# Altium schematic sheet Модуль ВЧ.SchDoc
size 594 x 420 mm; DocumentNumber: 9; SheetNumber: 9; SheetTotal: 11; ListNumber: 1
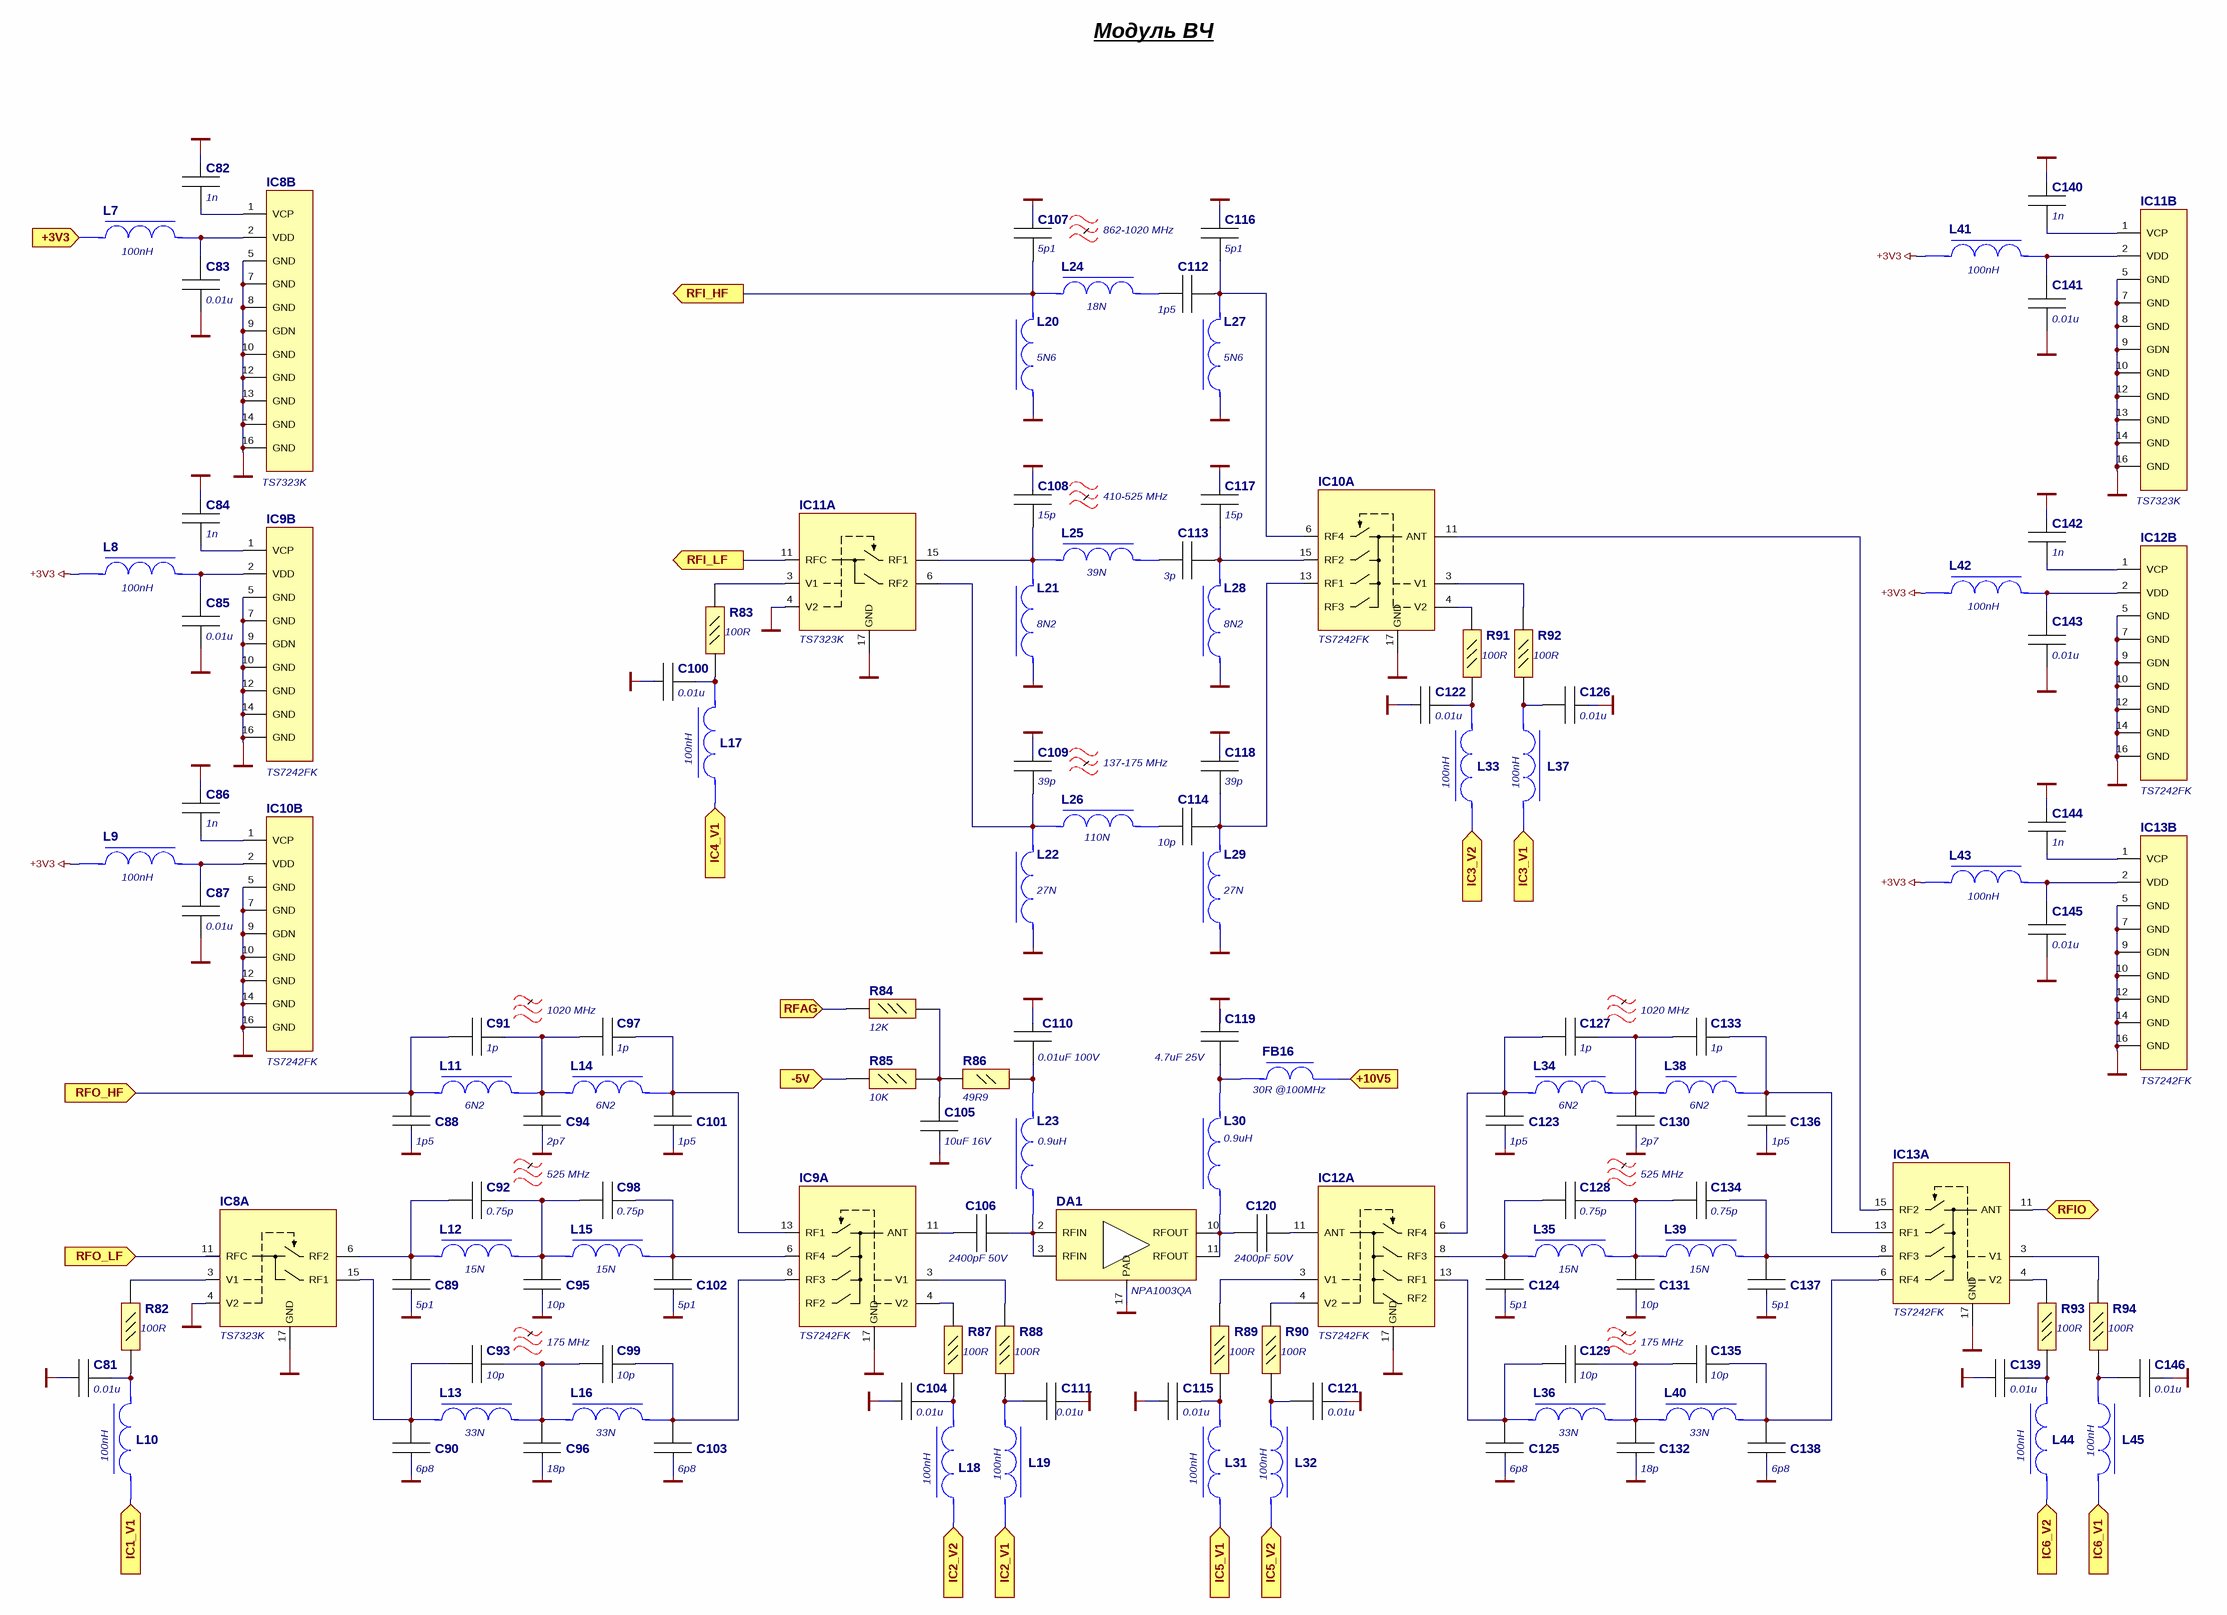
[diagram p0: Модуль ВЧ.SchDoc]

## Parts
C81  0.01u  [:CAP0402 100x50x50]
C82  1n  [:CAP0402 100x50x50]
C83  0.01u  [:CAP0402 100x50x50]
C84  1n  [:CAP0402 100x50x50]
C85  0.01u  [:CAP0402 100x50x50]
C86  1n  [:CAP0402 100x50x50]
C87  0.01u  [:CAP0402 100x50x50]
C88  1p5  [:CAP0603 C1608х08]
C89  5p1  [:CAP0603 C1608х08]
C90  6p8  [:CAP0603 C1608х08]
C91  1p  [:CAP0603 C1608х08]
C92  0.75p  [:CAP0603 C1608х08]
C93  10p  [:CAP0603 C1608х08]
C94  2p7  [:CAP0603 C1608х08]
C95  10p  [:CAP0603 C1608х08]
C96  18p  [:CAP0603 C1608х08]
C97  1p  [:CAP0603 C1608х08]
C98  0.75p  [:CAP0603 C1608х08]
C99  10p  [:CAP0603 C1608х08]
C100  0.01u  [:CAP0402 100x50x50]
C101  1p5  [:CAP0603 C1608х08]
C102  5p1  [:CAP0603 C1608х08]
C103  6p8  [:CAP0603 C1608х08]
C104  0.01u  [:CAP0402 100x50x50]
C105  10uF 16V  [:CAP0805 C2012X125]
C106  2400pF 50V  [:CAP0805 C2012X125]
C107  5p1  [:CAP0603 C1608х08]
C108  15p  [:CAP0603 C1608х08]
C109  39p  [:CAP0603 C1608х08]
C110  0.01uF 100V  [:CAP0603 C1608х08]
C111  0.01u  [:CAP0402 100x50x50]
C112  1p5  [:CAP0603 C1608х08]
C113  3p  [:CAP0603 C1608х08]
C114  10p  [:CAP0603 C1608х08]
C115  0.01u  [:CAP0402 100x50x50]
C116  5p1  [:CAP0603 C1608х08]
C117  15p  [:CAP0603 C1608х08]
C118  39p  [:CAP0603 C1608х08]
C119  4.7uF 25V  [:CAP0805 C2012X125]
C120  2400pF 50V  [:CAP0805 C2012X125]
C121  0.01u  [:CAP0402 100x50x50]
C122  0.01u  [:CAP0402 100x50x50]
C123  1p5  [:CAP0603 C1608х08]
C124  5p1  [:CAP0603 C1608х08]
C125  6p8  [:CAP0603 C1608х08]
C126  0.01u  [:CAP0402 100x50x50]
C127  1p  [:CAP0603 C1608х08]
C128  0.75p  [:CAP0603 C1608х08]
C129  10p  [:CAP0603 C1608х08]
C130  2p7  [:CAP0603 C1608х08]
C131  10p  [:CAP0603 C1608х08]
C132  18p  [:CAP0603 C1608х08]
C133  1p  [:CAP0603 C1608х08]
C134  0.75p  [:CAP0603 C1608х08]
C135  10p  [:CAP0603 C1608х08]
C136  1p5  [:CAP0603 C1608х08]
C137  5p1  [:CAP0603 C1608х08]
C138  6p8  [:CAP0603 C1608х08]
C139  0.01u  [:CAP0402 100x50x50]
C140  1n  [:CAP0402 100x50x50]
C141  0.01u  [:CAP0402 100x50x50]
C142  1n  [:CAP0402 100x50x50]
C143  0.01u  [:CAP0402 100x50x50]
C144  1n  [:CAP0402 100x50x50]
C145  0.01u  [:CAP0402 100x50x50]
C146  0.01u  [:CAP0402 100x50x50]
DA1  NPA1003QA  [:QFN16 P400X400X95-17N-D]
FB16  30R @100MHz  [:FER BLM18SP300SN1D]
IC8  TS7323K  [:QFN16 P300X300X80-17N-D]  (parts A,B of 2)
IC9  TS7242FK  [:QFN16 P300X300X80-17N-D]  (parts A,B of 2)
IC10  TS7242FK  [:QFN16 P300X300X80-17N-D]  (parts A,B of 2)
IC11  TS7323K  [:QFN16 P300X300X80-17N-D]  (parts A,B of 2)
IC12  TS7242FK  [:QFN16 P300X300X80-17N-D]  (parts A,B of 2)
IC13  TS7242FK  [:QFN16 P300X300X80-17N-D]  (parts A,B of 2)
L7  100nH  [:IND 0402]
L8  100nH  [:IND 0402]
L9  100nH  [:IND 0402]
L10  100nH  [:IND 0402]
L11  Manufacturer_Part_Number (part 2: value): 6N2  [:IND 0603 (1608)]
L12  Manufacturer_Part_Number (part 2: value): 15N  [:IND 0603 (1608)]  (hidden comment: LQW18AN...G8ZD)
L13  Manufacturer_Part_Number (part 2: value): 33N  [:IND 0603 (1608)]  (hidden comment: LQW18AN...G8ZD)
L14  Manufacturer_Part_Number (part 2: value): 6N2  [:IND 0603 (1608)]  (hidden comment: LQW18AN...G8ZD)
L15  Manufacturer_Part_Number (part 2: value): 15N  [:IND 0603 (1608)]  (hidden comment: LQW18AN...G8ZD)
L16  Manufacturer_Part_Number (part 2: value): 33N  [:IND 0603 (1608)]  (hidden comment: LQW18AN...G8ZD)
L17  100nH  [:IND 0402]
L18  100nH  [:IND 0402]
L19  100nH  [:IND 0402]
L20  Manufacturer_Part_Number (part 2: value): 5N6  [:IND 0603 (1608)]
L21  Manufacturer_Part_Number (part 2: value): 8N2  [:IND 0603 (1608)]  (hidden comment: LQW18AN...G8ZD)
L22  Manufacturer_Part_Number (part 2: value): 27N  [:IND 0603 (1608)]  (hidden comment: LQW18AN...G8ZD)
L23  0.9uH  [:IND 1008AF901XJLC]
L24  Manufacturer_Part_Number (part 2: value): 18N  [:IND 0603 (1608)]  (hidden comment: LQW18AN...G8ZD)
L25  Manufacturer_Part_Number (part 2: value): 39N  [:IND 0603 (1608)]  (hidden comment: LQW18AN...G8ZD)
L26  110N  [:IND 0603 (1608)]
L27  Manufacturer_Part_Number (part 2: value): 5N6  [:IND 0603 (1608)]  (hidden comment: LQW18AN...G8ZD)
L28  Manufacturer_Part_Number (part 2: value): 8N2  [:IND 0603 (1608)]  (hidden comment: LQW18AN...G8ZD)
L29  Manufacturer_Part_Number (part 2: value): 27N  [:IND 0603 (1608)]  (hidden comment: LQW18AN...G8ZD)
L30  0.9uH  [:IND 1008AF901XJLC]
L31  100nH  [:IND 0402]
L32  100nH  [:IND 0402]
L33  100nH  [:IND 0402]
L34  Manufacturer_Part_Number (part 2: value): 6N2  [:IND 0603 (1608)]  (hidden comment: LQW18AN...G8ZD)
L35  Manufacturer_Part_Number (part 2: value): 15N  [:IND 0603 (1608)]  (hidden comment: LQW18AN...G8ZD)
L36  Manufacturer_Part_Number (part 2: value): 33N  [:IND 0603 (1608)]  (hidden comment: LQW18AN...G8ZD)
L37  100nH  [:IND 0402]
L38  Manufacturer_Part_Number (part 2: value): 6N2  [:IND 0603 (1608)]  (hidden comment: LQW18AN...G8ZD)
L39  Manufacturer_Part_Number (part 2: value): 15N  [:IND 0603 (1608)]  (hidden comment: LQW18AN...G8ZD)
L40  Manufacturer_Part_Number (part 2: value): 33N  [:IND 0603 (1608)]  (hidden comment: LQW18AN...G8ZD)
L41  100nH  [:IND 0402]
L42  100nH  [:IND 0402]
L43  100nH  [:IND 0402]
L44  100nH  [:IND 0402]
L45  100nH  [:IND 0402]
R82  Manufacturer_Part_Number (part 2: value): 100R  [:RES0402]  (hidden comment: RC0402FR-07)
R83  Manufacturer_Part_Number (part 2: value): 100R  [:RES0402]  (hidden comment: RC0402FR-07)
R84  Manufacturer_Part_Number (part 2: value): 12K  [:RES0402]  (hidden comment: RC0402FR-07)
R85  Manufacturer_Part_Number (part 2: value): 10K  [:RES0402]  (hidden comment: RC0402FR-07)
R86  49R9  [:RES0805]
R87  Manufacturer_Part_Number (part 2: value): 100R  [:RES0402]  (hidden comment: RC0402FR-07)
R88  Manufacturer_Part_Number (part 2: value): 100R  [:RES0402]  (hidden comment: RC0402FR-07)
R89  Manufacturer_Part_Number (part 2: value): 100R  [:RES0402]  (hidden comment: RC0402FR-07)
R90  Manufacturer_Part_Number (part 2: value): 100R  [:RES0402]  (hidden comment: RC0402FR-07)
R91  Manufacturer_Part_Number (part 2: value): 100R  [:RES0402]  (hidden comment: RC0402FR-07)
R92  Manufacturer_Part_Number (part 2: value): 100R  [:RES0402]  (hidden comment: RC0402FR-07)
R93  Manufacturer_Part_Number (part 2: value): 100R  [:RES0402]  (hidden comment: RC0402FR-07)
R94  Manufacturer_Part_Number (part 2: value): 100R  [:RES0402]  (hidden comment: RC0402FR-07)

## Ports
+3V3 (in), +10V5 (in), -5V (in), IC1_V1 (in), IC2_V1 (in), IC2_V2 (in), IC3_V1 (in), IC3_V2 (in), IC4_V1 (in), IC5_V1 (in), IC5_V2 (in), IC6_V1 (in), IC6_V2 (in), RFAG (in), RFI_HF (out), RFI_LF (out), RFIO (bidir), RFO_HF (in), RFO_LF (in)

## Nets
+3V3: L8.1 L9.1 L41.1 L42.1 L43.1
GND: C81.2 C82.2 C83.1 C84.2 C85.1 C86.2 C87.1 C88.2 C89.2 C90.2 C94.2 C95.2 C96.2 C100.2 C101.2 C102.2 C103.2 C104.2 C105.1 C107.2 C108.2 C109.2 C110.1 C111.2 C115.2 C116.2 C117.2 C118.2 C119.1 C121.2 C122.2 C123.2 C124.2 C125.2 C126.2 C130.2 C131.2 C132.2 C136.2 C137.2 C138.2 C139.2 C140.2 C141.1 C142.2 C143.1 C144.2 C145.1 C146.2 DA1.17(PAD) IC8.4(V2) IC8.5(GND) IC8.7(GND) IC8.8(GND) IC8.9(GDN) IC8.10(GND) IC8.12(GND) IC8.13(GND) IC8.14(GND) IC8.16(GND) IC8.17(GND) IC9.5(GND) IC9.7(GND) IC9.9(GDN) IC9.10(GND) IC9.12(GND) IC9.14(GND) IC9.16(GND) IC9.17(GND) IC10.5(GND) IC10.7(GND) IC10.9(GDN) IC10.10(GND) IC10.12(GND) IC10.14(GND) IC10.16(GND) IC10.17(GND) IC11.4(V2) IC11.5(GND) IC11.7(GND) IC11.8(GND) IC11.9(GDN) IC11.10(GND) IC11.12(GND) IC11.13(GND) IC11.14(GND) IC11.16(GND) IC11.17(GND) IC12.5(GND) IC12.7(GND) IC12.9(GDN) IC12.10(GND) IC12.12(GND) IC12.14(GND) IC12.16(GND) IC12.17(GND) IC13.5(GND) IC13.7(GND) IC13.9(GDN) IC13.10(GND) IC13.12(GND) IC13.14(GND) IC13.16(GND) IC13.17(GND) L20.1 L21.1 L22.1 L27.1 L28.1 L29.1
+3V3: L7.1 ; port +3V3  [a separate net that carries the same name]
+10V5: FB16.2 ; port +10V5
-5V: R85.2 ; port -5V
IC1_V1: L10.1 ; port IC1_V1
IC2_V1: L19.1 ; port IC2_V1
IC2_V2: L18.1 ; port IC2_V2
IC3_V1: L37.1 ; port IC3_V1
IC3_V2: L33.1 ; port IC3_V2
IC4_V1: L17.1 ; port IC4_V1
IC5_V1: L31.1 ; port IC5_V1
IC5_V2: L32.1 ; port IC5_V2
IC6_V1: L45.1 ; port IC6_V1
IC6_V2: L44.1 ; port IC6_V2
RFAG: R84.2 ; port RFAG
RFI_HF: C107.1 L20.2 L24.1 ; port RFI_HF
RFI_LF: IC11.11(RFC) ; port RFI_LF
RFIO: IC13.11(ANT) ; port RFIO
RFO_HF: C88.1 C91.1 L11.1 ; port RFO_HF
RFO_LF: IC8.11(RFC) ; port RFO_LF
NetC81_1: C81.1 L10.2 R82.1
NetC82_1: C82.1 IC8.1(VCP)
NetC83_2: C83.2 IC8.2(VDD) L7.2
NetC84_1: C84.1 IC9.1(VCP)
NetC85_2: C85.2 IC9.2(VDD) L8.2
NetC86_1: C86.1 IC10.1(VCP)
NetC87_2: C87.2 IC10.2(VDD) L9.2
NetC89_1: C89.1 C92.1 IC8.6(RF2) L12.1
NetC90_1: C90.1 C93.1 IC8.15(RF1) L13.1
NetC91_2: C91.2 C94.1 C97.1 L11.2 L14.1
NetC92_2: C92.2 C95.1 C98.1 L12.2 L15.1
NetC93_2: C93.2 C96.1 C99.1 L13.2 L16.1
NetC97_2: C97.2 C101.1 IC9.13(RF1) L14.2
NetC98_2: C98.2 C102.1 IC9.6(RF4) L15.2
NetC99_2: C99.2 C103.1 IC9.8(RF3) L16.2
NetC100_1: C100.1 L17.2 R83.1
NetC104_1: C104.1 L18.2 R87.1
NetC105_2: C105.2 R84.1 R85.1 R86.1
NetC106_1: C106.1 IC9.11(ANT)
NetC106_2: C106.2 DA1.2(RFIN) DA1.3(RFIN) L23.1
NetC108_1: C108.1 IC11.15(RF1) L21.2 L25.1
NetC109_1: C109.1 IC11.6(RF2) L22.2 L26.1
NetC110_2: C110.2 L23.2 R86.2
NetC111_1: C111.1 L19.2 R88.1
NetC112_1: C112.1 L24.2
NetC112_2: C112.2 C116.1 IC10.6(RF4) L27.2
NetC113_1: C113.1 L25.2
NetC113_2: C113.2 C117.1 IC10.15(RF2) L28.2
NetC114_1: C114.1 L26.2
NetC114_2: C114.2 C118.1 IC10.13(RF1) L29.2
NetC115_1: C115.1 L31.2 R89.1
NetC119_2: C119.2 FB16.1 L30.2
NetC120_1: C120.1 DA1.10(RFOUT) DA1.11(RFOUT) L30.1
NetC120_2: C120.2 IC12.11(ANT)
NetC121_1: C121.1 L32.2 R90.1
NetC122_1: C122.1 L33.2 R91.1
NetC123_1: C123.1 C127.1 IC12.6(RF4) L34.1
NetC124_1: C124.1 C128.1 IC12.8(RF3) L35.1
NetC125_1: C125.1 C129.1 IC12.13(RF1) L36.1
NetC126_1: C126.1 L37.2 R92.1
NetC127_2: C127.2 C130.1 C133.1 L34.2 L38.1
NetC128_2: C128.2 C131.1 C134.1 L35.2 L39.1
NetC129_2: C129.2 C132.1 C135.1 L36.2 L40.1
NetC133_2: C133.2 C136.1 IC13.13(RF1) L38.2
NetC134_2: C134.2 C137.1 IC13.8(RF3) L39.2
NetC135_2: C135.2 C138.1 IC13.6(RF4) L40.2
NetC139_1: C139.1 L44.2 R93.1
NetC140_1: C140.1 IC11.1(VCP)
NetC141_2: C141.2 IC11.2(VDD) L41.2
NetC142_1: C142.1 IC12.1(VCP)
NetC143_2: C143.2 IC12.2(VDD) L42.2
NetC144_1: C144.1 IC13.1(VCP)
NetC145_2: C145.2 IC13.2(VDD) L43.2
NetC146_1: C146.1 L45.2 R94.1
NetIC8_3: IC8.3(V1) R82.2
NetIC9_3: IC9.3(V1) R88.2
NetIC9_4: IC9.4(V2) R87.2
NetIC10_3: IC10.3(V1) R92.2
NetIC10_4: IC10.4(V2) R91.2
NetIC10_11: IC10.11(ANT) IC13.15(RF2)
NetIC11_3: IC11.3(V1) R83.2
NetIC12_3: IC12.3(V1) R89.2
NetIC12_4: IC12.4(V2) R90.2
NetIC13_3: IC13.3(V1) R94.2
NetIC13_4: IC13.4(V2) R93.2

Not connected (* = marked no-connect by the designer): IC9 15(RF2); IC10 8(RF3); IC12 15(RF2)

## Notes on the sheet
- Модуль ВЧ
- 862-1020 MHz
- 410-525 MHz
- 137-175 MHz
- (near C97) 1020 MHz
- (near C133) 1020 MHz
- (near C98) 525 MHz
- (near C134) 525 MHz
- (near C99) 175 MHz
- (near C135) 175 MHz
- Подп. и дата
- Инв. № дубл.
- Взам. инв. №
- Инв. № подл.
- Лист
- Изм.
- № докум.
- Подп.
- Дата
- Копировал
- Формат А2

## Library data of the parts
C81 C83 C85 C87 C100 C104 C111 C115 C121 C122 C126 C139 C141 C143 C145 C146 = GRM1555CYA103JE01D: ±5% 35V Ceramic Capacitor C0G, NP0 0402 (1005 Metric); Manufacturer_Name: Murata Electronics; Short Description: 0402 0.01u 35V; Datasheet Link: https://search.murata.co.jp/Ceramy/image/img/A01X/G101/ENG/GRM1555CYA103JE01-01A.pdf; Height: 0.55mm; Manufacturer_Part_Number: GRM1555CYA103JE01D
C82 C84 C86 C140 C142 C144 = GRM1555C1H102JA01J: ±5% 50V Ceramic Capacitor C0G, NP0 0402 (1005 Metric); Manufacturer_Name: Murata Electronics; Short Description: 0402 1n 50V; Height: 0.55mm; Manufacturer_Part_Number: GRM1555C1H102JA01J
C88 C101 C112 C123 C136 = GQM1875C2E1R5BB12D: Ceramic Capacitor ±0.1pF 250V C0G, NP0 0603 (1608 Metric); Manufacturer_Name: Murata Electronics; Short Description: 0603 ±0.1pF NP0; Manufacturer_Part_Number: GQM1875C2E1R5BB12D
C89 C102 C107 C116 C124 C137 = GQM1875C2E5R1BB12D: Ceramic Capacitor ±0.1pF 250V C0G, NP0 0603 (1608 Metric); Manufacturer_Name: Murata Electronics; Short Description: 0603 ±0.1pF NP0; Manufacturer_Part_Number: GQM1875C2E5R1BB12D
C90 C103 C125 C138 = GQM1875C2E6R8BB12D: Ceramic Capacitor ±0.1pF 250V C0G, NP0 0603 (1608 Metric); Manufacturer_Name: Murata Electronics; Short Description: 0603 ±0.1pF NP0; Manufacturer_Part_Number: GQM1875C2E6R8BB12D
C91 C97 C127 C133 = GQM1875C2E1R0BB12D: Ceramic Capacitor ±0.1pF 250V C0G, NP0 0603 (1608 Metric); Manufacturer_Name: Murata Electronics; Short Description: 0603 ±0.1pF NP0; Manufacturer_Part_Number: GQM1875C2E1R0BB12D
C92 C98 C128 C134 = GQM1875C2ER75BB12D: Ceramic Capacitor ±0.1pF 250V C0G, NP0 0603 (1608 Metric); Manufacturer_Name: Murata Electronics; Short Description: 0603 ±0.1pF NP0; Manufacturer_Part_Number: GQM1875C2ER75BB12D
C93 C95 C99 C114 C129 C131 C135 = GQM1875C2E100FB12D: Ceramic Capacitor ±1% 250V C0G, NP0 0603 (1608 Metric); Manufacturer_Name: Murata Electronics; Short Description: 0603 ±1% NP0; Manufacturer_Part_Number: GQM1875C2E100FB12D
C94 C130 = GQM1875C2E2R7BB12D: Ceramic Capacitor ±0.1pF 250V C0G, NP0 0603 (1608 Metric); Manufacturer_Name: Murata Electronics; Short Description: 0603 ±0.1pF NP0; Manufacturer_Part_Number: GQM1875C2E2R7BB12D
C96 C132 = GQM1875C2E180FB12D: Ceramic Capacitor ±1% 250V C0G, NP0 0603 (1608 Metric); Manufacturer_Name: Murata Electronics; Short Description: 0603 ±1% NP0; Manufacturer_Part_Number: GQM1875C2E180FB12D
C105 = C2012X5R1C106M085AC: CAP CER 10uF 16V X5R 0805; Manufacturer_Name: TDK; Short Description: 0805 10uF 16V; Datasheet Link: https://product.tdk.com/info/en/documents/chara_sheet/C2012X5R1C106M085AC.pdf; Height: 1.45mm; Manufacturer_Part_Number: C2012X5R1C106M085AC; Mouser Part Number: 810-C2012X5R1C106M-2; Mouser Price/Stock: https://www.mouser.co.uk/ProductDetail/TDK/C2012X5R1C106M085AC?qs=LcTL%2F5vFEzFm8m4UBfhWvw%3D%3D; Arrow Part Number: C2012X5R1C106M085AC; Arrow Price/Stock: https://www.arrow.com/en/products/c2012x5r1c106m085ac/tdk
C106 C120 = C08BL242X-5UN-X0T: 2400pF 50V Ceramic Capacitor 0805 (2012 Metric); Manufacturer_Name: Knowles Novacap; Short Description: 0805 2400pF 50V; Manufacturer_Part_Number: C08BL242X-5UN-X0T
C108 C117 = GQM1875C2E150FB12D: Ceramic Capacitor ±1% 250V C0G, NP0 0603 (1608 Metric); Manufacturer_Name: Murata Electronics; Short Description: 0603 ±1% NP0; Manufacturer_Part_Number: GQM1875C2E150FB12D
C109 C118 = GQM1875C2E390FB12D: Ceramic Capacitor ±1% 250V C0G, NP0 0603 (1608 Metric); Manufacturer_Name: Murata Electronics; Short Description: 0603 ±1% NP0; Manufacturer_Part_Number: GQM1875C2E390FB12D
C110 = 06031C103JAT2A: CAP CER 0.01uF 100V X7R 0603; Manufacturer_Name: AVX; Short Description: 0603 0.01uF 100V; Datasheet Link: http://datasheets.avx.com/X7RDielectric.pdf; Height: 0.9mm; Manufacturer_Part_Number: 06031C103JAT2A; Mouser Part Number: 581-06031C103J; Mouser Price/Stock: https://www.mouser.co.uk/ProductDetail/AVX/06031C103JAT2A?qs=PvDVvsUKiFRCqwRkH01KSw%3D%3D; Arrow Part Number: 06031C103JAT2A; Arrow Price/Stock: https://www.arrow.com/en/products/06031c103jat2a/avx
C113 = GQM1875C2E3R0BB12D: Ceramic Capacitor ±0.1pF 250V C0G, NP0 0603 (1608 Metric); Manufacturer_Name: Murata Electronics; Short Description: 0603 ±0.1pF NP0; Manufacturer_Part_Number: GQM1875C2E3R0BB12D
C119 = GRM21BZ71E475KE15L: CAP CER 4.7uF 25V X7R 0805; Manufacturer_Name: Murata Electronics; Short Description: 0805 4.7uF 25V; Datasheet Link: https://search.murata.co.jp/Ceramy/image/img/A01X/G101/ENG/GRM21BZ71E475KE15-01.pdf; Height: 1.45mm; Manufacturer_Part_Number: GRM21BZ71E475KE15L
DA1 = NPA1003QA: GaN 20 - 1500 MHz Power Amplifier 16dB 5W; Manufacturer_Name: MACOM; Short Description: 16dB 5W; Datasheet Link: https://cdn.macom.com/datasheets/NPA1003QA.pdf; Height: 0.95mm; Manufacturer_Part_Number: NPA1003QA; Mouser Part Number: 937-NPA1003QA; Mouser Price/Stock: https://www.mouser.co.uk/ProductDetail/MACOM/NPA1003QA?qs=%2F9lm7XkpNBiuAdOeTJvWuA%3D%3D
FB16 = BLM18SP300SN1D: 30 Ohms @ 100MHz 1 Power Line Ferrite Bead 0603 (1608 Metric) 6A 8mOhm; Manufacturer_Name: Murata Electronics; Short Description: 0603 30R @100MHz; Datasheet Link: http://www.murata.com/~/media/webrenewal/support/library/catalog/products/emc/emifil/c31e.ashx?la=en-gb; Height: 0.95mm; Manufacturer_Part_Number: BLM18SP300SN1D; Mouser Part Number: 81-BLM18SP300SN1D; Mouser Price/Stock: https://www.mouser.co.uk/ProductDetail/Murata-Electronics/BLM18SP300SN1D/?qs=W%2FMpXkg%252BdQ4o%252BOP%252B6m8FYA%3D%3D
IC8 IC11 = TS7323K: SPDT Switch 1MHz to 1GHz; Manufacturer_Name: Tagore Technology; Manufacturer_Part_Number: TS7323KMTRPBF; Short Description: SPDT
IC9 IC10 IC12 IC13 = TS7242FK: SP4T Switch 10MHz to 3GHz; Manufacturer_Name: Tagore Technology; Manufacturer_Part_Number: TS7242FKMTRPBF; Short Description: SP4T
L7-L10 L17-L19 L31-L33 L37 L41-L45 = LQG15HNR10J02D: Unshielded Multilayer Inductor 0402 5%; Manufacturer_Name: Murata Electronics; Short Description: 100nH 200mA 1.6Ohm; Manufacturer_Part_Number: LQG15HNR10J02D
L11-L16 L20-L22 L24 L25 L27-L29 L34-L36 L38-L40 = LQW18AN...G8ZD: Unshielded Non-Magnetic Core Inductor 0603 2% / Value Range: 2.2n ... 390n / Example for value from 2.2n to 94n: / 2.2n = 2N2 / .... / 94n = 94N / Example for value from 100n to 390n: / 100n = R10 / .... / 390n = R39; Manufacturer_Name: Murata Electronics; Manufacturer_Part_Number (part 3: after value): G8ZD; Short Description: 0603 2%; Datasheet Link: https://search.murata.co.jp/Ceramy/image/img/P02/JELF243A-9133.pdf; Manufacturer_Part_Number: LQW18AN
L23 L30 = 1008AF-901XJLC: Fixed Inductors 1008 0.9uH Unshld 5% 1.3A 100mOhms / Current - Saturation (Isat) 1.4 A / Current Rating (Amps) 1.3 A / Frequency - Self Resonant  415 MHz; Manufacturer_Name: Coilcraft; Short Description: 0.9uH 1.3A 100mOhm; Manufacturer_Part_Number: 1008AF-901XJLC
L26 = LQW18AN...G8ZD: Unshielded Non-Magnetic Core Inductor 0603 2% / Value Range: 2.2n ... 390n / Example for value from 2.2n to 94n: / 2.2n = 2N2 / .... / 94n = 94N / Example for value from 100n to 390n: / 100n = R10 / .... / 390n = R39; Manufacturer_Name: Murata Electronics; Manufacturer_Part_Number (part 3: after value): G8ZD; Manufacturer_Part_Number (part 2: value): R11; Short Description: 0603 2%; Datasheet Link: https://search.murata.co.jp/Ceramy/image/img/P02/JELF243A-9133.pdf; Manufacturer_Part_Number: LQW18AN
R82-R85 R87-R94 = RC0402FR-07: Resistor 0402 1% 1/16W / Value Range: 1Ω ... 10 MΩ / Value Example: / 0R = 0Ω / 97R6 = 97.6Ω / 9K76 = 9760Ω / 1M = 1,000,000Ω; Manufacturer_Name: YAGEO; Manufacturer_Part_Number (part 3: after value): L; Short Description: 0402 1%; Datasheet Link: http://www.yageo.com/documents/recent/PYu-RC0402_51_RoHS_L_6_r.pdf; Height: 0.4mm; Manufacturer_Part_Number: RC0402FR-07; Parameter 1: *
R86 = ERJ-6ENF49R9V: 49.9 Ohms ±1% 0.125W, 1/8W Chip Resistor 0805 (2012 Metric) Automotive AEC-Q200 Thick Film; Manufacturer_Name: Panasonic; Datasheet Link: https://industrial.panasonic.com/cdbs/www-data/pdf/RDA0000/AOA0000C84.pdf; Height: 0.7mm; Manufacturer_Part_Number: ERJ-6ENF49R9V; Mouser Part Number: 667-ERJ-6ENF49R9V; Mouser Price/Stock: https://www.mouser.co.uk/ProductDetail/Panasonic/ERJ-6ENF49R9V?qs=qCGL2%252BBFAqUwh1urNYOtNA%3D%3D; Arrow Part Number: ERJ-6ENF49R9V; Arrow Price/Stock: https://www.arrow.com/en/products/erj-6enf49r9v/panasonic